# EAGLE design ADPD103-Breakout (EAGLE 7.3.0)
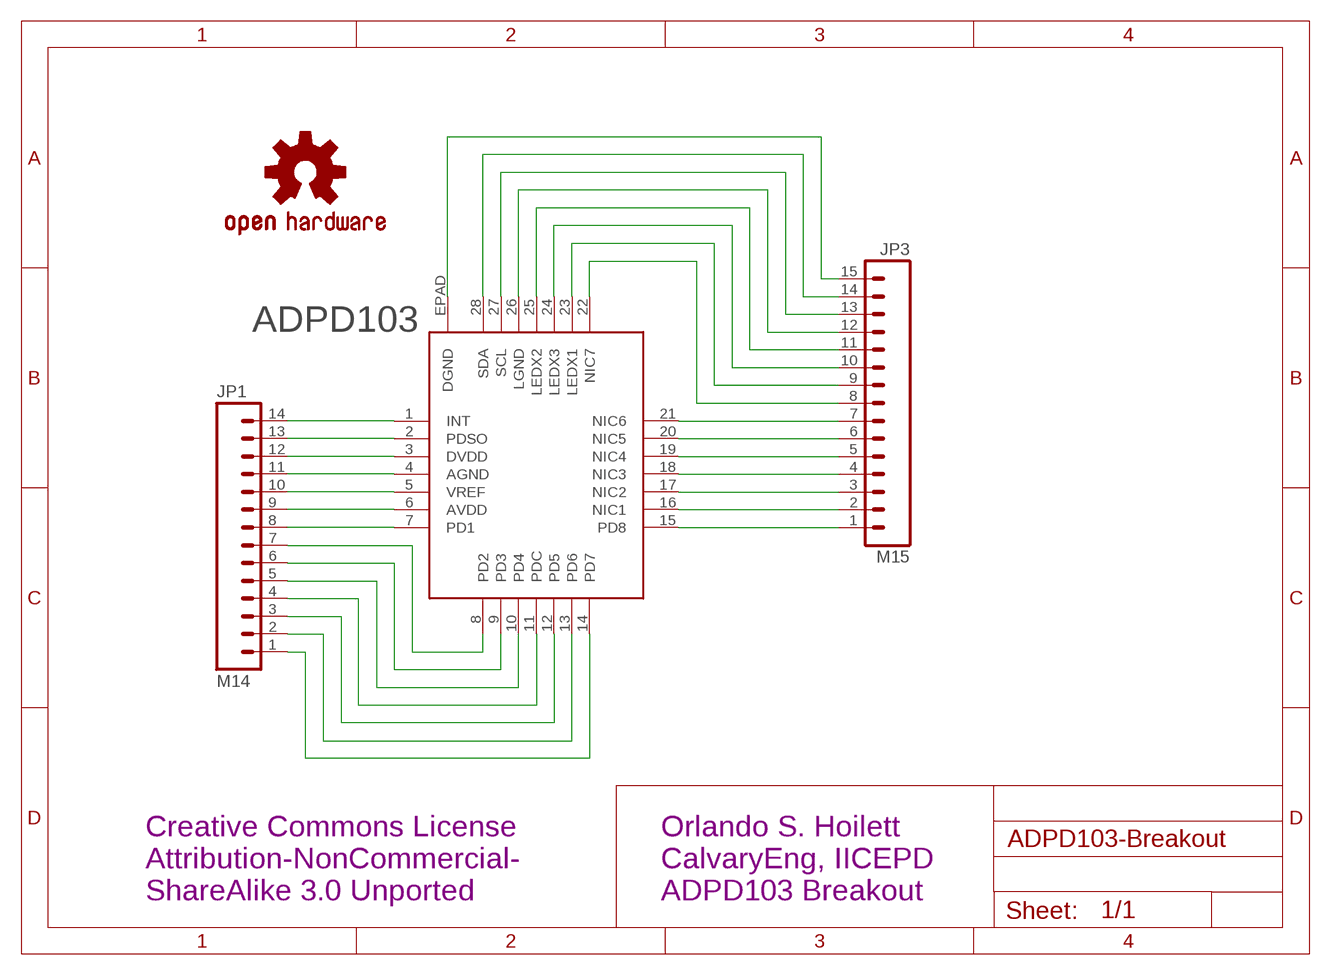
[diagram p0: schematic, sheet 1]

## Parts
JP1  M14  [1X14]
JP3  M15  [1X15]
LOGO1  OSHW-LOGOS  [OSHW-LOGO-S]
U$1  ADPD103  [28-LFCSP]

## Nets
N$1: JP1.14 U$1.1(INT)
N$2: JP1.13 U$1.2(PDSO)
N$3: JP1.12 U$1.3(DVDD)
N$4: JP1.11 U$1.4(AGND)
N$5: JP1.10 U$1.5(VREF)
N$6: JP1.9 U$1.6(AVDD)
N$7: JP1.8 U$1.7(PD1)
N$8: JP1.7 U$1.8(PD2)
N$9: JP1.6 U$1.9(PD3)
N$10: JP1.5 U$1.10(PD4)
N$11: JP1.4 U$1.11(PDC)
N$12: JP1.3 U$1.12(PD5)
N$13: JP1.2 U$1.13(PD6)
N$14: JP1.1 U$1.14(PD7)
N$15: JP3.1 U$1.15(PD8)
N$16: JP3.2 U$1.16(NIC1)
N$17: JP3.3 U$1.17(NIC2)
N$18: JP3.4 U$1.18(NIC3)
N$19: JP3.5 U$1.19(NIC4)
N$20: JP3.6 U$1.20(NIC5)
N$21: JP3.7 U$1.21(NIC6)
N$22: JP3.8 U$1.22(NIC7)
N$23: JP3.15 U$1.EPAD(DGND)
N$24: JP3.14 U$1.28(SDA)
N$25: JP3.13 U$1.27(SCL)
N$26: JP3.12 U$1.26(LGND)
N$27: JP3.11 U$1.25(LEDX2)
N$28: JP3.10 U$1.24(LEDX3)
N$29: JP3.9 U$1.23(LEDX1)

## Notes on the sheet
- Creative Commons License
  Attribution-NonCommercial-
  ShareAlike 3.0 Unported
- Orlando S. Hoilett
  CalvaryEng, IICEPD
  ADPD103 Breakout

## Library data of the parts
JP1 = SparkFun-Connectors:M14: Header 14 Standard 14-pin 0.1" header. Use with straight break away headers (SKU : PRT-00116), right angle break away headers (PRT-00553), swiss pins (PRT-00743), machine pins (PRT-00117), and female headers (PRT-00115).
JP3 = SparkFun-Connectors:M15: Header 15 Standard 15-pin 0.1" header. Use with straight break away headers (SKU : PRT-00116), right angle break away headers (PRT-00553), swiss pins (PRT-00743), machine pins (PRT-00117), and female headers (PRT-00115).
LOGO1 = SparkFun-Aesthetics:OSHW-LOGO: Open Source Hardware Logo This logo indicates the piece of hardware it is found on incorporates a OSHW license and/or adheres to the definition of open source hardware found here: http://freedomdefined.org/OSHW
U$1 = Orlando:ADPD103

## Board
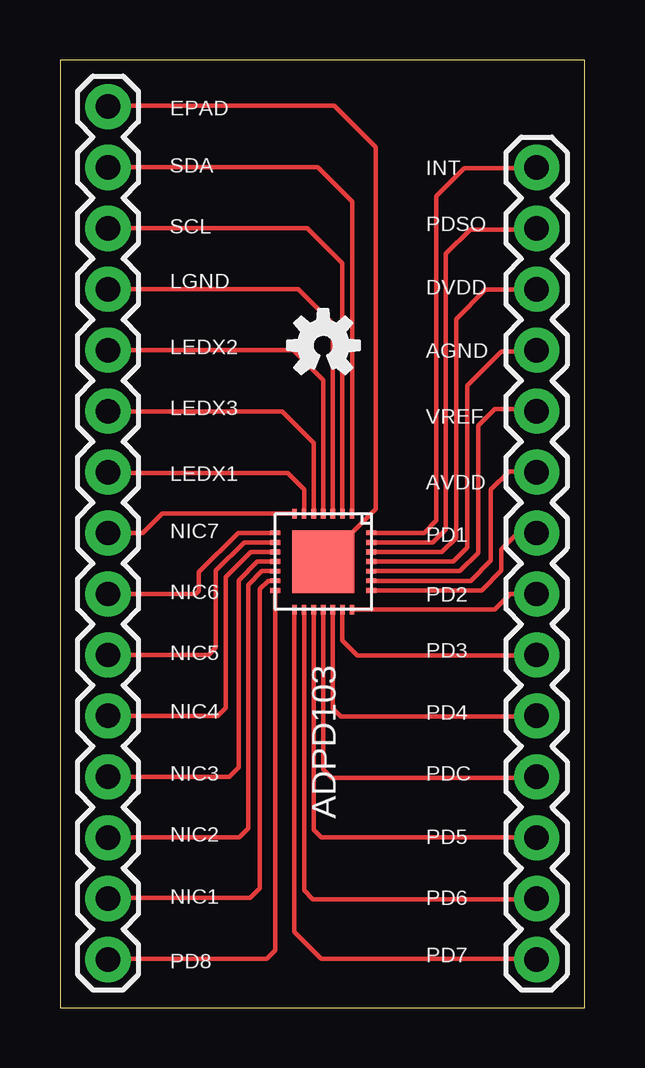
[diagram p1: board, top side]

Size 21.86 x 39.5 mm. Coordinates in mm from the lower left corner, seen from the top.
Outline: 0,0 21.86,0 21.86,39.5 0,39.5 0,0
Copper layers (1*16): Top 0.0356mm / dielectric 1.5011mm / Bottom 0.0356mm
Design rules "LaenPCBOrder": minimum track width 6mil, minimum drill 13mil, track to track 6mil, track to pad 6mil, pad to pad 6mil, via to via 6mil, smd to smd 6mil, copper to edge 15mil, drill to drill 6mil, minimum pad ring 7mil, minimum via ring 7mil, stop-mask expansion 3mil, vias tented up to drill 0mil, thermal gap 10mil

### Footprints (pad centres in the part's own frame; a part is rotated, then mirrored left to right if it is on the bottom)
1X14 = drill 1.016 pad 1.88: 1 0,0; 2 2.54,0; 3 5.08,0; 4 7.62,0; 5 10.16,0; 6 12.7,0; 7 15.24,0; 8 17.78,0; 9 20.32,0; 10 22.86,0; 11 25.4,0; 12 27.94,0; 13 30.48,0; 14 33.02,0
1X15 = drill 1.016 pad 1.88: 1 0,0; 2 2.54,0; 3 5.08,0; 4 7.62,0; 5 10.16,0; 6 12.7,0; 7 15.24,0; 8 17.78,0; 9 20.32,0; 10 22.86,0; 11 25.4,0; 12 27.94,0; 13 30.48,0; 14 33.02,0; 15 35.56,0
28-LFCSP = smd 0.4 x 0.2: 1 2,1.2; 2 2,0.8; 3 2,0.4; 4 2,0; 5 2,-0.4; 6 2,-0.8; 7 2,-1.2; 15 -2,-1.2; 16 -2,-0.8; 17 -2,-0.4; 18 -2,0; 19 -2,0.4; 20 -2,0.8; 21 -2,1.2 | smd 0.2 x 0.4: 8 1.2,-2; 9 0.8,-2; 10 0.4,-2; 11 0,-2; 12 -0.4,-2; 13 -0.8,-2; 14 -1.2,-2; 22 -1.2,2; 23 -0.8,2; 24 -0.4,2; 25 0,2; 26 0.4,2; 27 0.8,2; 28 1.2,2 | smd 2.6 x 2.6: EPAD 0,0

### Placement (x,y rotation side)
JP1  19.86,2 90 top
JP3  2,2 90 top
LOGO1  10.97,27.6 0 top
U$1  10.97,18.59 0 top

### Tracks (layer width: path | path; a pad name or v marks a point on that pad's centre or on a via)
N$1
  Top 0.178: U$1.1 15.17,19.79 15.67,20.29 15.67,33.83 16.84,35 19.84,35 JP1.14
N$2
  Top 0.178: U$1.2 15.53,19.39 16.07,19.94 16.07,31.42 17.09,32.43 19.81,32.43 JP1.13
N$3
  Top 0.178: U$1.3 15.92,18.99 16.51,19.58 16.51,28.7 17.73,29.92 19.84,29.92 JP1.12
N$4
  Top 0.178: U$1.4 16.38,18.59 16.96,19.17 16.96,25.93 18.39,27.35 19.81,27.35 JP1.11
N$5
  Top 0.178: U$1.5 16.67,18.19 17.42,18.95 17.42,24.25 18.11,24.94 19.78,24.94 JP1.10
N$6
  Top 0.178: U$1.6 17.1,17.79 17.95,18.64 17.95,21.59 18.72,22.35 19.83,22.35 JP1.9
N$7
  Top 0.178: U$1.7 17.57,17.39 18.39,18.21 18.39,19.1 19.02,19.73 19.81,19.73 JP1.8
N$8
  Top 0.178: U$1.8 18.11,16.59 18.77,17.24 JP1.7
N$9
  Top 0.178: U$1.9 11.77,15.3 12.39,14.68 19.84,14.68 JP1.6
N$10
  Top 0.178: U$1.10 11.37,12.47 11.71,12.14 19.84,12.14 JP1.5
N$11
  Top 0.178: U$1.11 10.97,9.93 11.33,9.57 19.81,9.57 JP1.4
N$12
  Top 0.178: U$1.12 10.57,7.41 10.89,7.08 JP1.3
N$13
  Top 0.178: U$1.13 10.17,4.89 10.54,4.52 19.84,4.52 JP1.2
N$14
  Top 0.178: U$1.14 9.77,3.15 10.89,2.03 19.83,2.03 JP1.1
N$15
  Top 0.178: U$1.15 8.97,2.39 8.61,2.03 2.03,2.03 JP3.1
N$16
  Top 0.178: U$1.16 8.67,17.79 8.33,17.45 8.33,4.98 7.92,4.57 2.03,4.57 JP3.2
N$17
  Top 0.178: U$1.17 8.41,18.19 7.85,17.62 7.85,7.46 7.46,7.08 JP3.3
N$18
  Top 0.178: U$1.18 8.23,18.59 7.44,17.8 7.44,10.01 7.06,9.62 JP3.4
N$19
  Top 0.178: U$1.19 7.94,18.99 6.91,17.95 6.91,12.49 6.58,12.16 JP3.5
N$20
  Top 0.178: U$1.20 7.68,19.39 6.5,18.21 6.5,15.01 6.2,14.7 JP3.6
N$21
  Top 0.178: U$1.21 7.42,19.79 5.79,18.16 5.79,17.37 5.66,17.24 JP3.7
N$22
  Top 0.178: U$1.22 4.26,20.59 3.45,19.78 JP3.8
N$23
  Top 0.178: U$1.EPAD 13.15,20.77 13.15,35.86 11.43,37.59 2.03,37.59 JP3.15
N$24
  Top 0.178: U$1.28 12.17,33.59 10.74,35.02 JP3.14
N$25
  Top 0.178: U$1.27 11.77,31.02 10.31,32.48 JP3.13
N$26
  Top 0.178: U$1.26 11.37,28.5 9.93,29.94 JP3.12
N$27
  Top 0.178: U$1.25 10.97,26.16 9.72,27.4 JP3.11
N$28
  Top 0.178: U$1.24 10.57,23.54 9.27,24.84 2.02,24.84 JP3.10
N$29
  Top 0.178: U$1.23 10.17,21.6 9.5,22.27 2.05,22.27 JP3.9

### Text on the board
_tsilk: EPAD | SDA | INT | SCL | PDSO | LGND | DVDD | LEDX2 | AGND | LEDX3 | VREF | LEDX1 | AVDD | NIC7 | PD1 | NIC6 | PD2 | PD3 | NIC5 | NIC4 | PD4 | NIC3 | PDC | NIC2 | PD5 | NIC1 | PD6 | PD8 | PD7
_bsilk: Orlando S. Hoilett / CalvaryEng, IICEPD / ADPD103 Breakout